# Altium schematic sheet LED-kube-kontrollerkort_v0-0-1.SchDoc
size A4
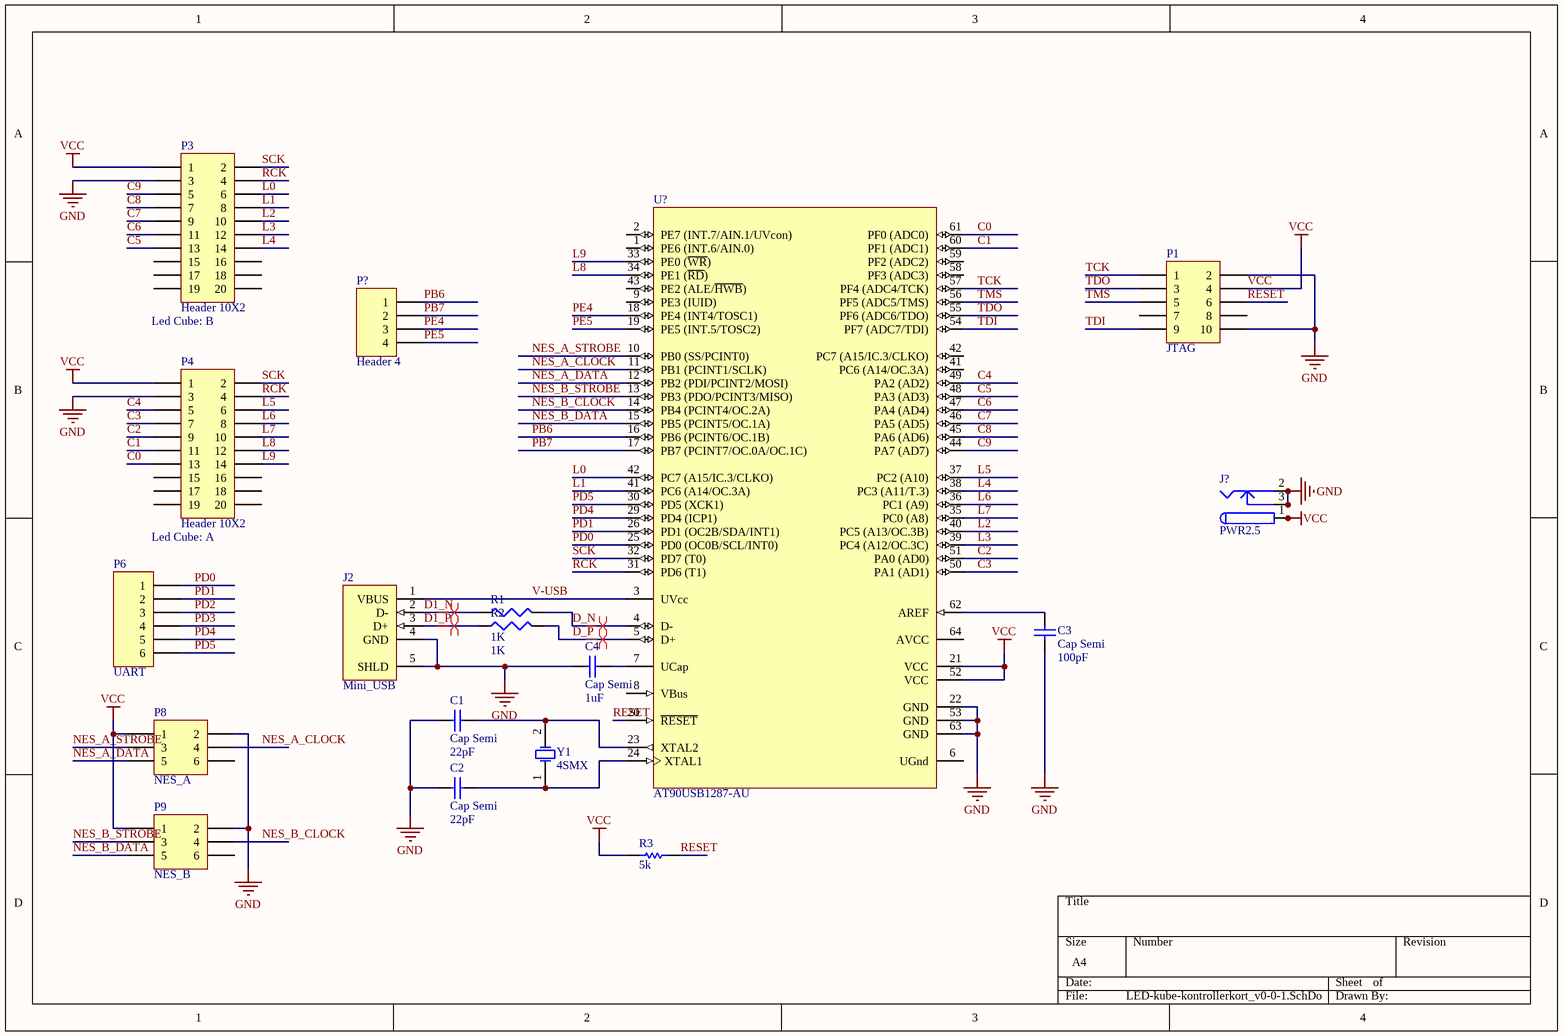
[diagram p0: LED-kube-kontrollerkort_v0-0-1.SchDoc]

## Parts
C1  Cap Semi  value 22pF  [8-1206]
C2  Cap Semi  value 22pF  [8-1206]
C3  Cap Semi  value 100pF  [8-1206]
C4  Cap Semi  value 1uF  [8-1206]
J2  Mini_USB  [481900001]
J?  PWR2.5  [KLD-0202]
P1  JTAG  [HDR2X5]
P3  Header 10X2  Led Cube: B  [HDR2X10]
P4  Header 10X2  Led Cube: A  [HDR2X10]
P6  UART  [HDR1X6]
P8  NES_A  [HDR2X3]
P9  NES_B  [HDR2X3]
P?  Header 4  [HDR1X4]
R1  value 1K  [8-1206]
R2  value 1K  [8-1206]
R3  5k  [8-1206]
U?  AT90USB1287-AU  [64MD_N]
Y1  4SMX  [4SMX]

## Nets
GND: C1.1 C2.1 C3.1 C4.1 J2.4(GND) J2.5(SHLD) J?.2 J?.2A J?.2B J?.3 J?.3A J?.3B P1.2 P1.10 P3.3 P4.3 P8.2 P9.2 U?.22(GND) U?.53(GND) U?.63(GND)
VCC: J?.1 J?.1A J?.1B P1.4 P3.1 P4.1 P8.1 P9.1 R3.1 U?.21(VCC) U?.52(VCC)
C0: P4.13 U?.61(PF0_(ADC0))
C1: P4.11 U?.60(PF1_(ADC1))
C2: P4.9 U?.51(PA0_(AD0))
C3: P4.7 U?.50(PA1_(AD1))
C4: P4.5 U?.49(PA2_(AD2))
C5: P3.13 U?.48(PA3_(AD3))
C6: P3.11 U?.47(PA4_(AD4))
C7: P3.9 U?.46(PA5_(AD5))
C8: P3.7 U?.45(PA6_(AD6))
C9: P3.5 U?.44(PA7_(AD7))
D1_N: J2.2(D-) R1.1
D1_P: J2.3(D+) R2.1
D_N: R1.2 U?.4(D-)
D_P: R2.2 U?.5(D+)
L0: P3.6 U?.42(PC7_(A15/IC.3/CLKO))
L1: P3.8 U?.41(PC6_(A14/OC.3A))
L2: P3.10 U?.40(PC5_(A13/OC.3B))
L3: P3.12 U?.39(PC4_(A12/OC.3C))
L4: P3.14 U?.38(PC3_(A11/T.3))
L5: P4.6 U?.37(PC2_(A10))
L6: P4.8 U?.36(PC1_(A9))
L7: P4.10 U?.35(PC0_(A8))
L8: P4.12 U?.34(PE1_(~{RD}))
L9: P4.14 U?.33(PE0_(~{WR}))
NES_A_CLOCK: P8.4 U?.11(PB1_(PCINT1/SCLK))
NES_A_DATA: P8.5 U?.12(PB2_(PDI/PCINT2/MOSI))
NES_A_STROBE: P8.3 U?.10(PB0_(SS/PCINT0))
NES_B_CLOCK: P9.4 U?.14(PB4_(PCINT4/OC.2A))
NES_B_DATA: P9.5 U?.15(PB5_(PCINT5/OC.1A))
NES_B_STROBE: P9.3 U?.13(PB3_(PDO/PCINT3/MISO))
PB6: P?.1 U?.16(PB6_(PCINT6/OC.1B))
PB7: P?.2 U?.17(PB7_(PCINT7/OC.0A/OC.1C))
PD0: P6.1 U?.25(PD0_(OC0B/SCL/INT0))
PD1: P6.2 U?.26(PD1_(OC2B/SDA/INT1))
PD2: P6.3
PD3: P6.4
PD4: P6.5 U?.29(PD4_(ICP1))
PD5: P6.6 U?.30(PD5_(XCK1))
PE4: P?.3 U?.18(PE4_(INT4/TOSC1))
PE5: P?.4 U?.19(PE5_(INT.5/TOSC2))
RCK: P3.4 P4.4 U?.31(PD6_(T1))
RESET: P1.6 R3.2 U?.20(~{RESET})
SCK: P3.2 P4.2 U?.32(PD7_(T0))
TCK: P1.1 U?.57(PF4_(ADC4/TCK))
TDI: P1.9 U?.54(PF7_(ADC7/TDI))
TDO: P1.3 U?.55(PF6_(ADC6/TDO))
TMS: P1.5 U?.56(PF5_(ADC5/TMS))
V-USB: J2.1(VBUS) U?.3(UVcc)
NetC1_2: C1.2 U?.23(XTAL2) Y1.2(OSC2)
NetC2_2: C2.2 U?.24(XTAL1) Y1.1(OSC1)
NetC3_2: C3.2 U?.62(AREF)
NetC4_2: C4.2 U?.7(UCap)

Not connected (* = marked no-connect by the designer): P1 7 8; P3 15 16 17 18 19 20; P4 15 16 17 18 19 20; P8 6; P9 6; U? 1(PE6_(INT.6/AIN.0)) 2(PE7_(INT.7/AIN.1/UVcon)) 6(UGnd) 8(VBus) 9(PE3_(IUID)) 43(PE2_(ALE/~{HWB})) 58(PF3_(ADC3)) 59(PF2_(ADC2)) 64(AVCC)

## Layout directives
differential pair: D1_N, D1_P, D_N, D_P

## Library data of the parts
C1-C4 = Cap Semi: Capacitor (Semiconductor SIM Model); Published: 8-Jun-2000; LatestRevisionDate: 29-May-2009; LatestRevisionNote: IPC-7351 Footprint Added.; PackageReference: C1206; Publisher: Altium Limited; PackageDescription: Chip Capacitor
J2 = Mini_USB: USB 2.0, Right Angle, SMT, B Type, Receptacle, 5 Position, Black; ContactMaterial: Copper Alloy; ContactPlating: Gold (30); PCB_Layout: Complies with manufacturer's recommendation.; DrillSize: Corresponds to nominal value.; PanelGround: Without; Published: 15-Jul-2004; DatasheetDocument: 27-Jun-2003; PackageDocument: 27-Jun-2003; PackageReference: 440247; Publisher: Altium Limited; HousingMaterial: Thermoplastic; ComponentLink1Description: Manufacturer Link; ComponentLink1URL: http://www.tycoelectronics.com/; ComponentLink2Description: Packaging Specification; ComponentLink2URL: http://ecommas.tycoelectronics.com/commerce/DocumentDelivery/DDEController?Action=showdoc&DocId=Customer+Drawing%7F440247%7FD%7Fpdf%7FEnglish%7FC_440247_D.pdf
J? = PWR2.5: Low Voltage Power Supply Connector; Published: 17-Dec-2003; DatasheetDocument: 09-May-2002; Publisher: Altium Limited; ComponentLink1Description: Manufacturer Link; ComponentLink1URL: http://domino.kycon.com/internet/Products.html
P1 = Header 5X2: Header, 5-Pin, Dual row; LatestRevisionDate: 17-Jul-2002; LatestRevisionNote: Re-released for DXP Platform.; Publisher: Altium Limited
P3 P4 = Header 10X2: Header, 10-Pin, Dual row; LatestRevisionDate: 17-Jul-2002; LatestRevisionNote: Re-released for DXP Platform.; Publisher: Altium Limited
P6 = Header 6: Header, 6-Pin; LatestRevisionDate: 17-Jul-2002; LatestRevisionNote: Re-released for DXP Platform.; Publisher: Altium Limited
P8 P9 = Header 3X2: Header, 3-Pin, Dual row; LatestRevisionDate: 17-Jul-2002; LatestRevisionNote: Re-released for DXP Platform.; Publisher: Altium Limited
P? = Header 4: Header, 4-Pin; LatestRevisionDate: 17-Jul-2002; LatestRevisionNote: Re-released for DXP Platform.; Publisher: Altium Limited
R1 R2 = Res3: Resistor; Published: 8-Jun-2000; LatestRevisionDate: 29-May-2009; LatestRevisionNote: IPC-7351 Footprint Added.; PackageReference: J1-0603; Publisher: Altium Limited; PackageDescription: Chip Resistor
R3 = ERJP08J: Anti-Surge Thick Film Chip Resistor, 10 Ohm to 1M Ohm Range, 5% Tolerance, 1206 Size, 0.25 W; Note: If flow soldering, adjust pad width of PCB Footprint to 0.7 - 0.8 times the width of the resistor.; Published: 17-Dec-2003; LatestRevisionDate: 19-Mar-2004; LatestRevisionNote: Silkscreen size reduced.; PackageDocument: Mar-2003; PackageReference: 8-1206; Publisher: Altium Limited; Code_IPC: 3216 [1206]; ComponentLink1Description: Manufacturer Link; ComponentLink1URL: http://www.panasonic.com/industrial/components/resistive_products.htm; ComponentLink2Description: Datasheet; ComponentLink2URL: http://www.panasonic.com/industrial/components/pdf/AOA0000CE4.pdf
U? = AT90USB1287-AU: 8-bit AVR Microcontroller, 2.7-5.5V, 128KB Flash, 4KB EEPROM, 8KB SRAM, USB OTG Host, 64-pin TQFP, Industrial Grade (-40°C to 85°C); Published: 1-Apr-2010; DatasheetVersion: revK, Nov-2009; PackageVersion: revF, Jul-2007; PackageReference: 64MD; Publisher: Altium Limited; PackageDescription: 64-Pin Plastic Thin Profile Quad Flat Pack, 14 x 14 x 1.0 mm Body, 0.8 mm Pitch (TQFP); Supplier 1: Digi-Key; Supplier Part Number 1: AT90USB1287-AU-ND; Supplier 2: Farnell; Supplier Part Number 2: 1748496; Supplier 3: Mouser; Supplier Part Number 3: 556-AT90USB1287-AU; Code_JEDEC: MS-026-AEB; ComponentLink1Description: Manufacturer Link; ComponentLink1URL: http://www.atmel.com/products/avr/default.asp?; ComponentLink2Description: AT90USB1286/1287/646/647 Datasheet; ComponentLink2URL: http://www.atmel.com/dyn/resources/prod_documents/doc7593.pdf; ComponentLink3Description: AT90USB1286/1287/646/647 Summary; ComponentLink3URL: http://www.atmel.com/dyn/resources/prod_documents/7593S.pdf; ComponentLink4Description: Atmel.com Home; ComponentLink4URL: http://www.atmel.com
Y1 = 4SMX: Surface Mount Quartz Crystal; Note: PCB layout complies with manufacturer's recommendation.; Published: 17-Jul-2002; DatasheetDocument: 9-Sep-1999; PackageDocument: 9-Sep-1999; PackageReference: 4SMX; Publisher: Altium Limited; ComponentLink1Description: Manufacturer Link; ComponentLink1URL: http://www.cmac.com/mt/